# EAGLE design 503DC24 (EAGLE 7.6.0)
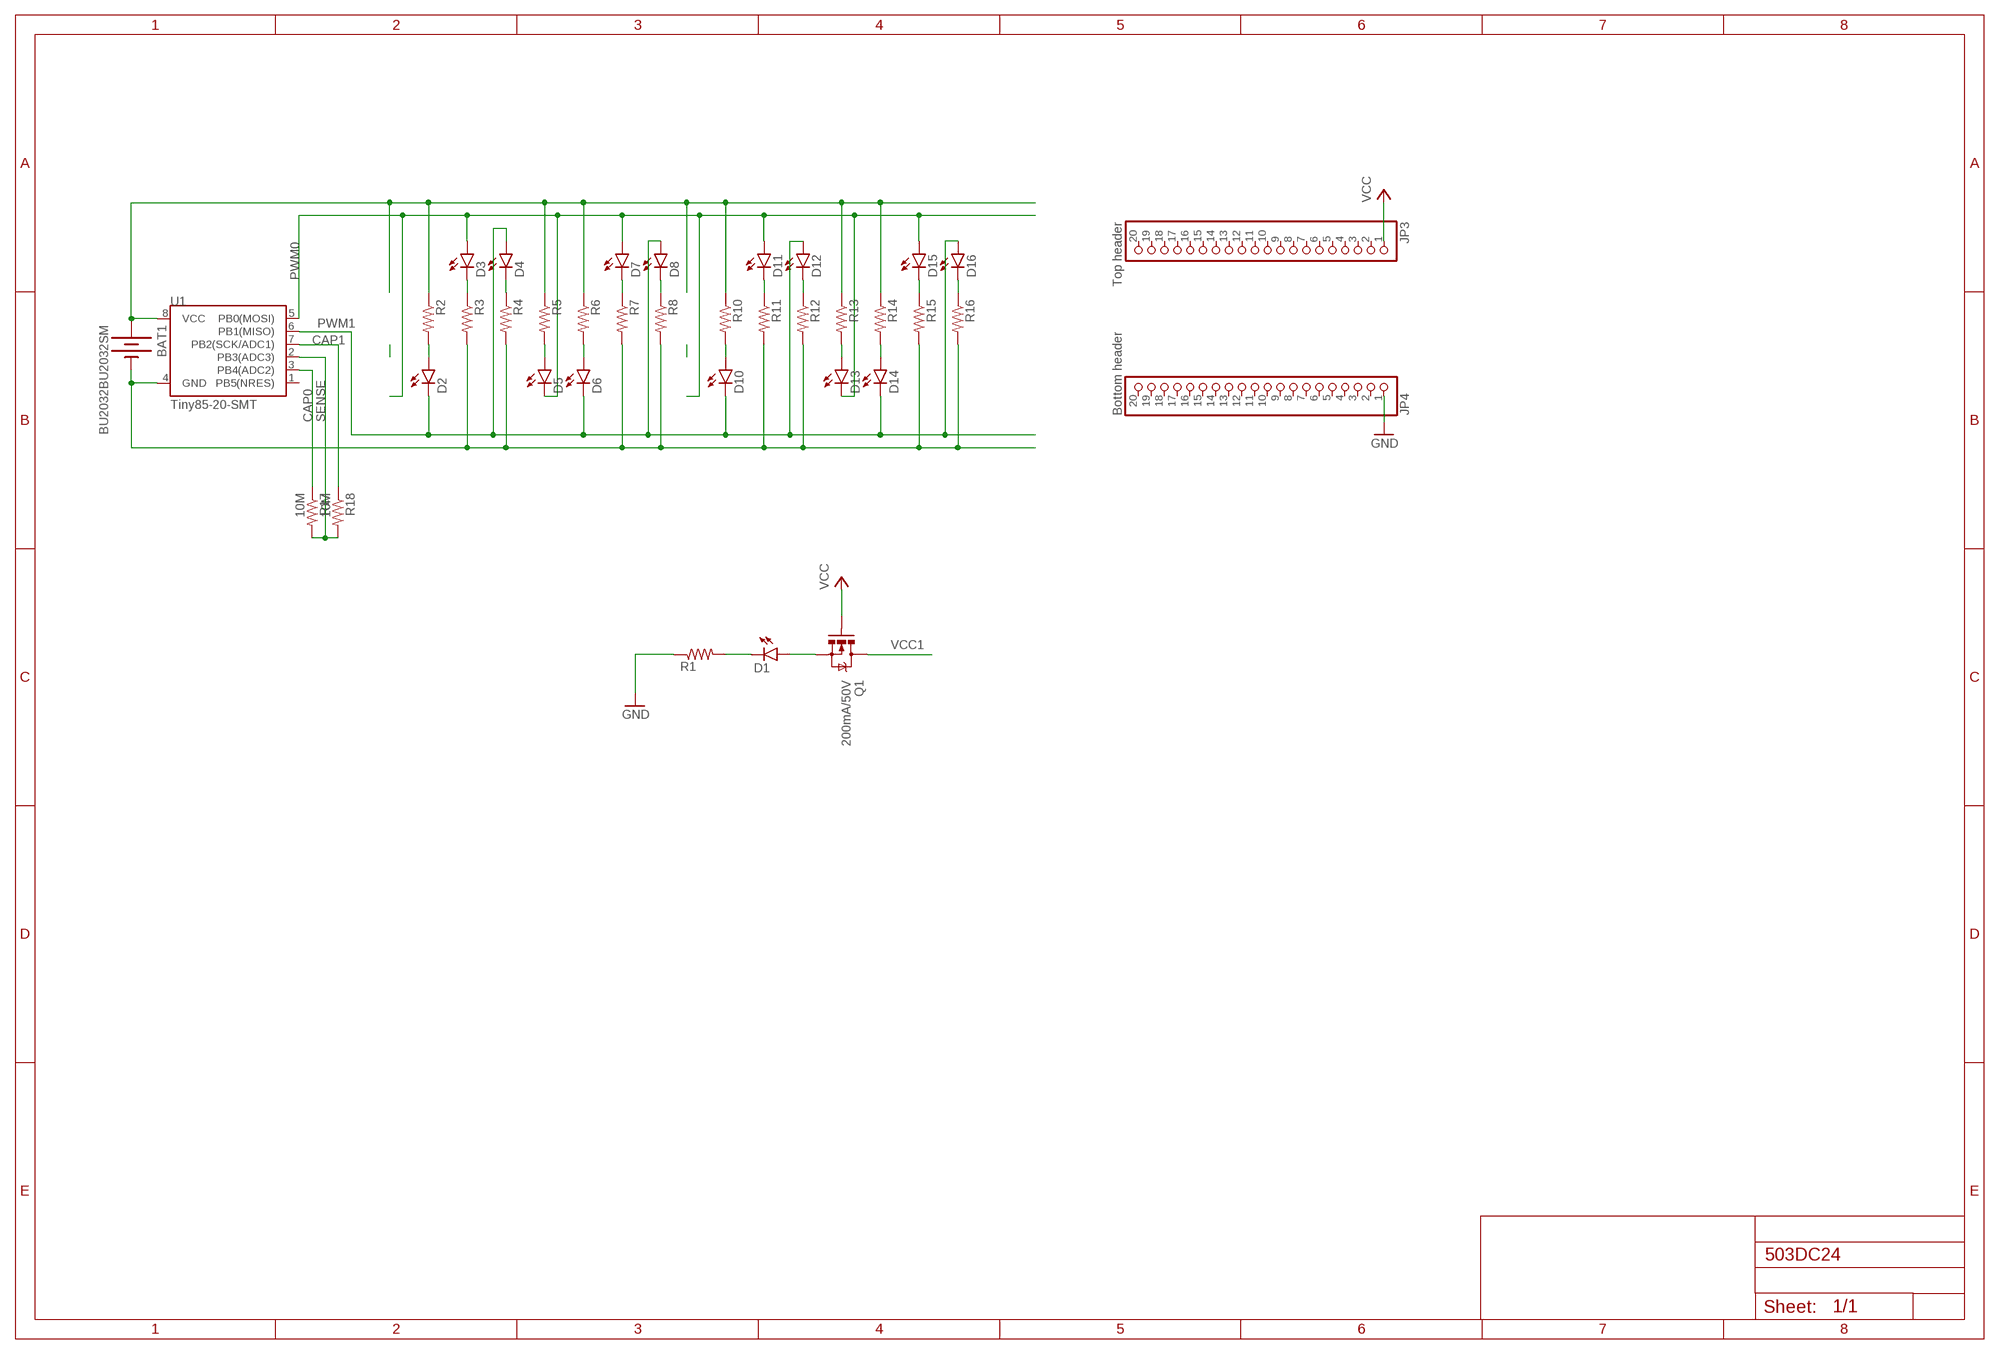
[diagram p0: schematic, sheet 1]

## Parts
BAT1  BU2032BU2032SM  [BU2032SM]
D1  LED1206-BOTTOM-SMALL_SILK  [LED-REV-MNT-SMALLSILK]
D2  LED1206-BOTTOM-SMALL_SILK  [LED-REV-MNT-SMALLSILK]
D3  LED1206-BOTTOM-SMALL_SILK  [LED-REV-MNT-SMALLSILK]
D4  LED1206-BOTTOM-SMALL_SILK  [LED-REV-MNT-SMALLSILK]
D5  LED1206-BOTTOM-SMALL_SILK  [LED-REV-MNT-SMALLSILK]
D6  LED1206-BOTTOM-SMALL_SILK  [LED-REV-MNT-SMALLSILK]
D7  LED1206-BOTTOM-SMALL_SILK  [LED-REV-MNT-SMALLSILK]
D8  LED1206-BOTTOM-SMALL_SILK  [LED-REV-MNT-SMALLSILK]
D10  LED1206-BOTTOM-SMALL_SILK  [LED-REV-MNT-SMALLSILK]
D11  LED1206-BOTTOM-SMALL_SILK  [LED-REV-MNT-SMALLSILK]
D12  LED1206-BOTTOM-SMALL_SILK  [LED-REV-MNT-SMALLSILK]
D13  LED1206-BOTTOM-SMALL_SILK  [LED-REV-MNT-SMALLSILK]
D14  LED1206-BOTTOM-SMALL_SILK  [LED-REV-MNT-SMALLSILK]
D15  LED1206-BOTTOM-SMALL_SILK  [LED-REV-MNT-SMALLSILK]
D16  LED1206-BOTTOM-SMALL_SILK  [LED-REV-MNT-SMALLSILK]
JP3  Top header  PINHD-1X20  [1X20]
JP4  Bottom header  PINHD-1X20  [1X20]
Q1  200mA/50V  MOSFET-NCHANNELBSS138  [SOT23-3]
R1  RESISTOR1206  [1206]
R2  RESISTOR1206  [1206]
R3  RESISTOR1206  [1206]
R4  RESISTOR1206  [1206]
R5  RESISTOR1206  [1206]
R6  RESISTOR1206  [1206]
R7  RESISTOR1206  [1206]
R8  RESISTOR1206  [1206]
R10  RESISTOR1206  [1206]
R11  RESISTOR1206  [1206]
R12  RESISTOR1206  [1206]
R13  RESISTOR1206  [1206]
R14  RESISTOR1206  [1206]
R15  RESISTOR1206  [1206]
R16  RESISTOR1206  [1206]
R17  10M  RESISTOR0805-RES  [0805]
R18  10M  RESISTOR0805-RES  [0805]
U1  Tiny85-20-SMT  ATTINY45TINY85-20-SMT  [SO08-EIAJ]

## Nets
CAP0: R17.1 U1.3(PB4(ADC2))
CAP1: R18.1 U1.7(PB2(SCK/ADC1))
GND: JP4.1 R1.1
GND1: BAT1.P-(-) R3.2 R4.2 R7.2 R8.2 R11.2 R12.2 R15.2 R16.2 U1.4(GND)
N$2: D2.A R2.2
N$3: D3.C R3.1
N$4: D4.C R4.1
N$5: D5.A R5.2
N$6: D6.A R6.2
N$7: D16.C R16.1
N$8: D15.C R15.1
N$14: D10.A R10.2
N$15: D12.C R12.1
N$16: D11.C R11.1
N$17: D8.C R8.1
N$18: D7.C R7.1
N$21: D13.A R13.2
N$22: D14.A R14.2
N$27: D1.A Q1.2(S)
N$30: D1.C R1.2
PWM0: D3.A D5.C D7.A D11.A D13.C D15.A U1.5(PB0(MOSI))
PWM1: D2.C D4.A D6.C D8.A D10.C D12.A D14.C D16.A U1.6(PB1(MISO))
SENSE: R17.2 R18.2 U1.2(PB3(ADC3))
VCC: JP3.1 Q1.1(G)
VCC1: BAT1.P+(+) Q1.3(D) R2.1 R5.1 R6.1 R10.1 R13.1 R14.1 U1.8(VCC)
Unconnected: JP3.2 JP3.3 JP3.4 JP3.5 JP3.6 JP3.7 JP3.8 JP3.9 JP3.10 JP3.11 JP3.12 JP3.13 JP3.14 JP3.15 JP3.16 JP3.17 JP3.18 JP3.19 JP3.20 JP4.2 JP4.3 JP4.4 JP4.5 JP4.6 JP4.7 JP4.8 JP4.9 JP4.10 JP4.11 JP4.12 JP4.13 JP4.14 JP4.15 JP4.16 JP4.17 JP4.18 JP4.19 JP4.20 U1.1(PB5(NRES))

## Library data of the parts
BAT1 = Electromechanical:BU2032
D1-D8 D10-D16 = LED:LED: LEDs Standard schematic elements and footprints for 5mm, 3mm, 1206, and 0603 sized LEDs. 5mm - Spark Fun Electronics SKU : COM-00529 (and others)
JP3 JP4 = pinhead:PINHD-1X20: PIN HEADER
Q1 = SparkFun-DiscreteSemi:MOSFET-NCHANNEL: Common NMOSFET Parts MFG P/N Store ID Prod ID FDD8780 TRANS-09984 SI7820DN TRANS-11055 FDS6630A IC-08089 2N7002PW TRANS-11151 FQP30N06L COM-10213 TRANS-10060 BSS123LT1G TRANS-08345 BSS138 TRANS-00830 BS170 2N7000; PROD_ID: TRANS-00830
R1-R8 R10-R18 = SparkFun-Passives:RESISTOR: Resistor Basic schematic elements and footprints for 0603, 1206, and PTH resistors.
U1 = SparkFun-DigitalIC:ATTINY45: Atmel 8-pin 2/4/8kB flash uC; PROD_ID: IC-09092

## Board
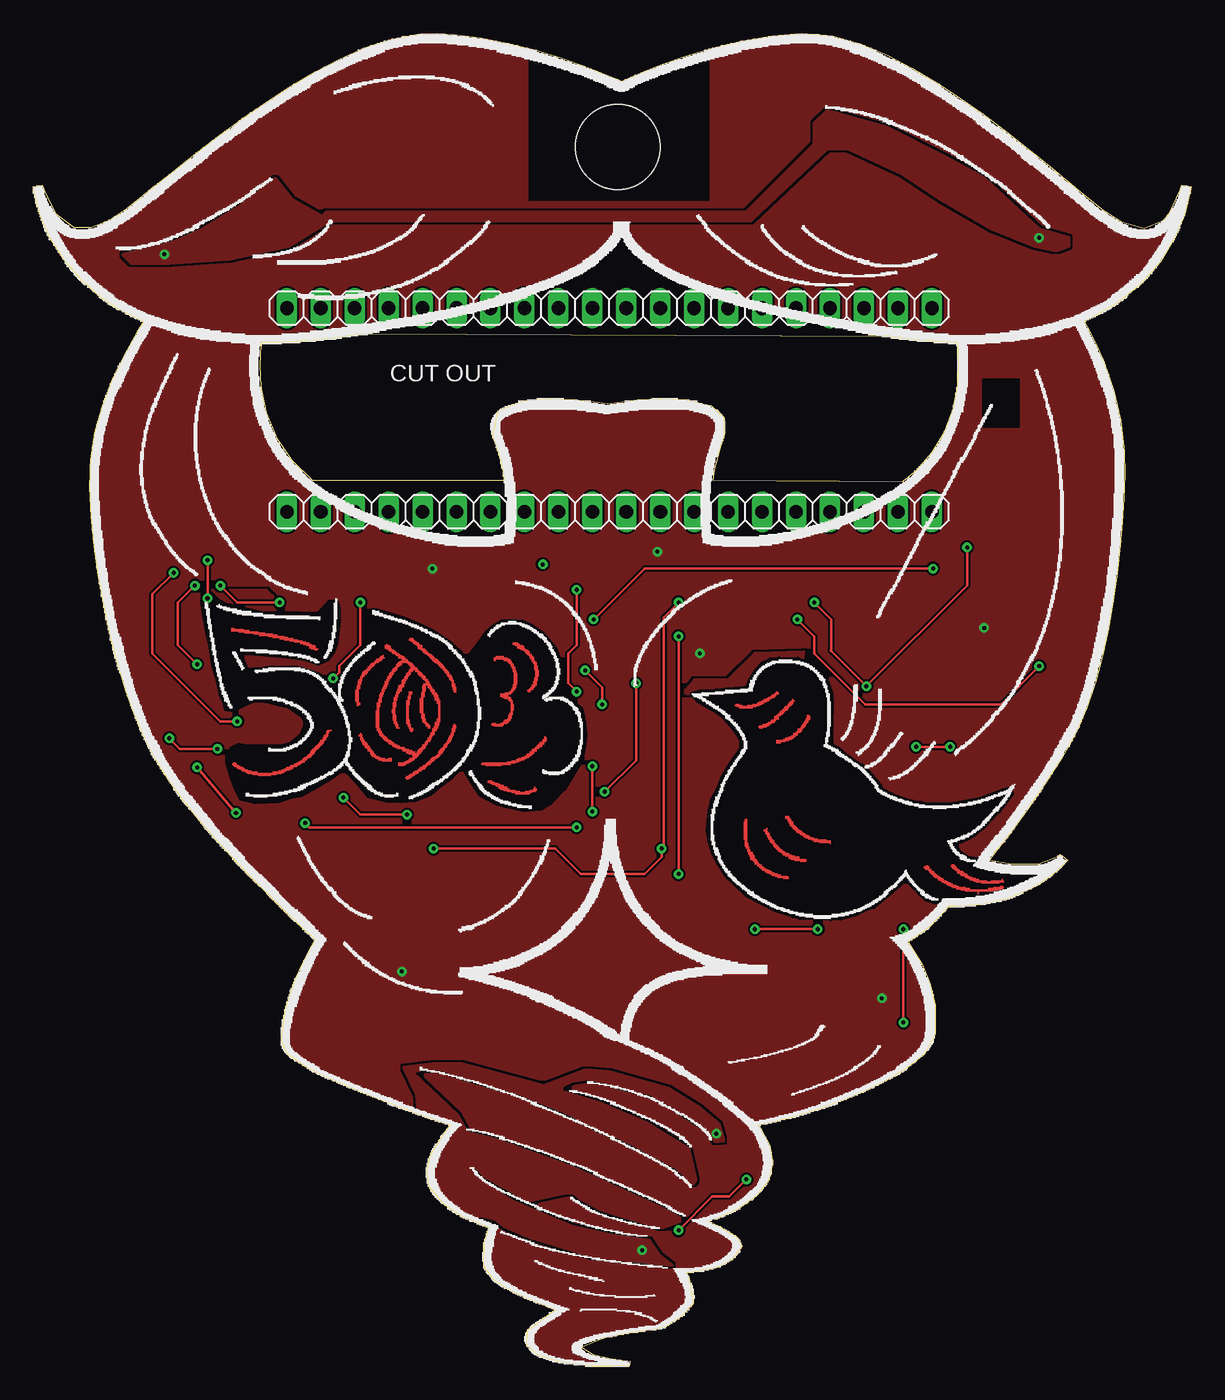
[diagram p1: board, top side]
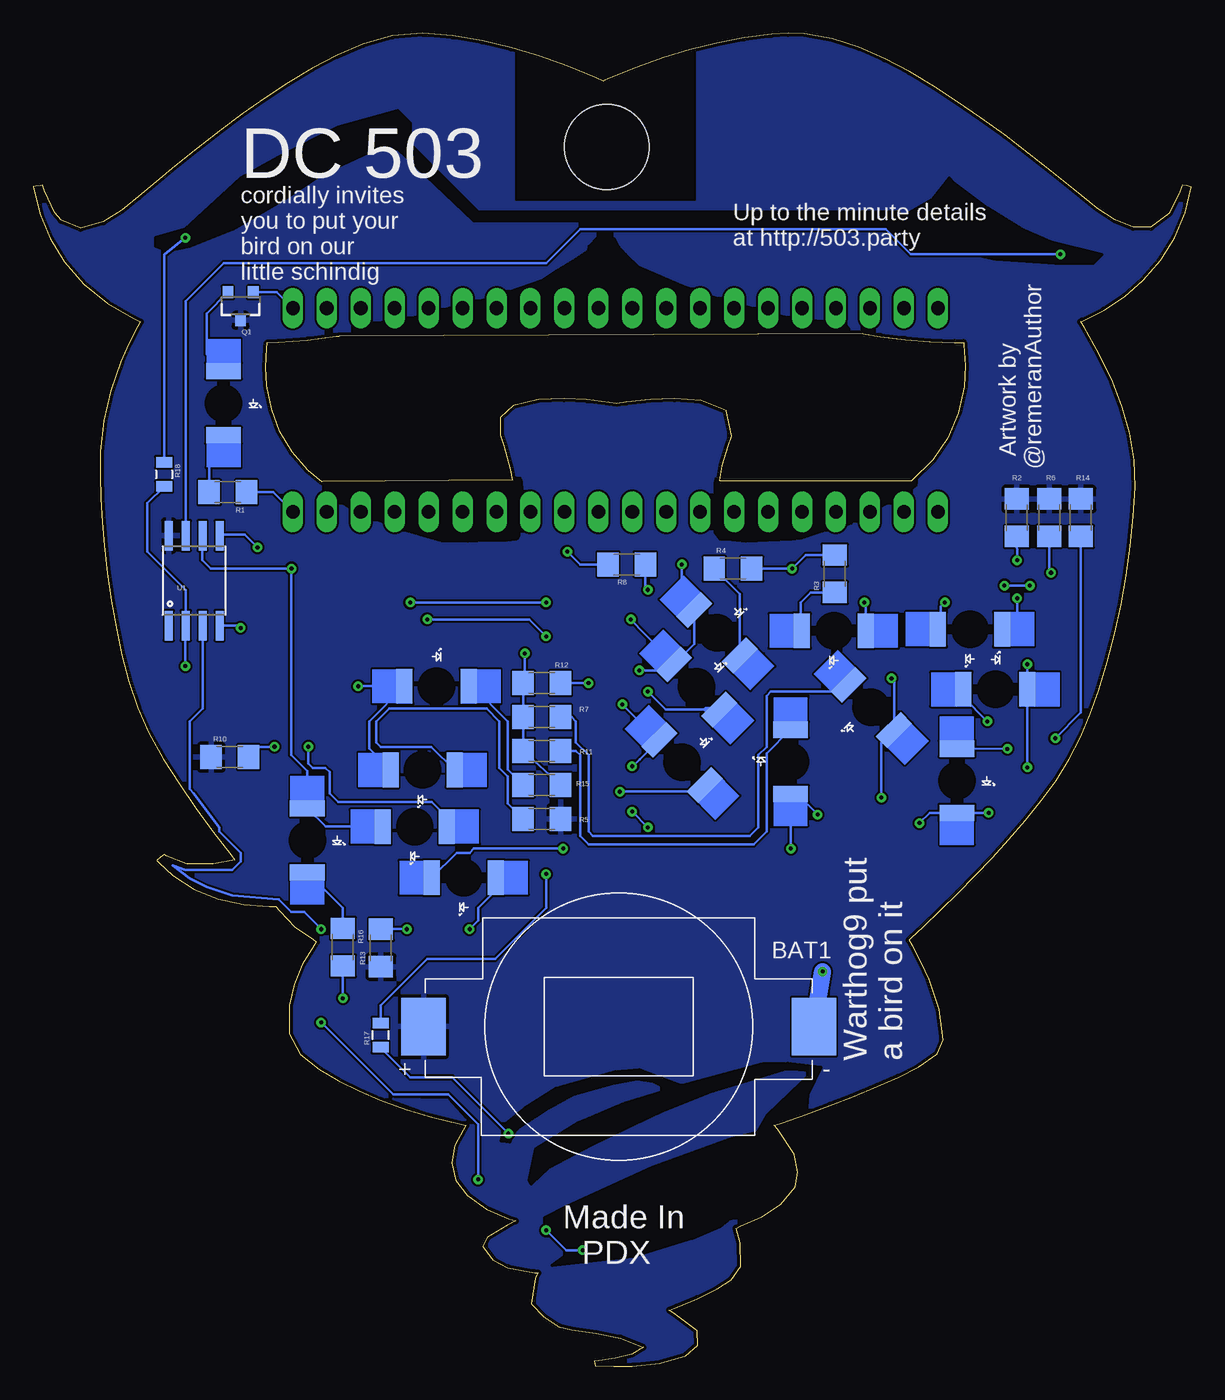
[diagram p2: board, bottom side, seen from below]

Size 86.63 x 99.75 mm. Coordinates in mm from the lower left corner, seen from the top.
Outline: 41.81,0 39.77,0.21 37.8,0.78 36.91,1.55 36.97,2.63 38.74,4 39.04,4.18 38.51,4.41 36.97,5.04 35.47,5.78 34.43,6.47 33.7,7.46 33.74,9.21 34.06,10.31 33.72,10.5 32.14,11.18 30.7,12.09 29.63,13.41 29.44,14.49 29.72,15.85 30.95,17.72 31.18,18.01 30.59,18.22 28.8,18.86 27.02,19.52 25.25,20.2 23.49,20.92 21.92,21.62 20.39,22.39 18.99,23.37 18.54,24.4 18.86,26.72 19.6,28.94 20.19,30.21 20.84,31.44 21.1,31.9 20.95,32.04 20.05,32.88 18.74,34.15 17.45,35.43 16.16,36.72 14.9,38.03 13.63,39.43 12.4,40.86 11.23,42.33 10.11,43.85 9.13,45.44 8.28,47.1 7.55,48.82 6.92,50.58 6.27,52.7 5.72,54.84 5.25,57 4.86,59.18 4.55,61.38 4.32,63.58 4.2,65.79 4.27,67.82 4.6,69.82 5.15,71.78 5.87,73.68 6.86,75.76 8,77.76 8.27,78.18 8.16,78.23 6.51,79.05 4.98,80.06 3.6,81.28 2.29,82.79 1.23,84.48 0.46,86.32 0,88.26 0.34,88.34 0.67,88.41 0.7,88.33 0.89,87.8 1.67,86.26 3.02,85.23 4.34,85.24 5.73,85.82 6.99,86.64 8.78,88.08 10.48,89.45 12.2,90.8 13.93,92.13 15.69,93.42 17.49,94.65 19.26,95.8 21.08,96.87 22.94,97.85 24.87,98.7 26.87,99.36 28.95,99.73 30.17,99.75 31.39,99.68 33.45,99.42 35.49,99.02 37.51,98.52 39.5,97.92 41.46,97.23 42.67,96.75 43.87,96.24 44.01,96.17 44.56,96.42 46.63,97.28 48.74,98.03 50.88,98.67 53.06,99.19 55.27,99.57 57.49,99.75 59.77,99.57 61.97,98.93 63.91,98.11 65.77,97.13 67.58,96.06 69.34,94.9 71.06,93.69 72.74,92.43 74.4,91.14 76.04,89.82 77.66,88.47 78.78,87.52 80.04,86.51 81.39,85.64 83.1,85.16 84.56,85.77 85.03,86.32 85.79,87.94 85.94,88.39 86.1,88.37 86.44,88.31 86.63,88.27 86.61,88.1 86.13,86.19 85.36,84.37 84.33,82.69 82.85,80.98 81.1,79.56 79.15,78.43 78.63,78.18 78.82,77.84 79.5,76.53 80.1,75.19 80.84,73.01 81.36,70.76 81.62,68.47 81.65,66.7 81.58,64.94 81.47,63.18 81.32,61.42 81.09,59.36 80.8,57.31 80.45,55.27 80.01,53.24 79.48,51.24 78.82,49.27 78,47.37 76.91,45.45 75.72,43.59 74.47,41.77 73.17,39.99 71.81,38.25 71.56,37.87 73.16,37.58 75.17,37.57 76.71,38.19 76.84,38.3 77.13,38.08 77.39,37.86 77.25,37.7 76.21,36.71 74.58,35.69 72.79,34.97 70.91,34.56 68.99,34.42 68.49,34.42 68.2,34.05 67.06,32.87 65.71,31.95 65.45,31.74 65.66,31.45 66.5,30.07 67.12,28.56 67.47,26.98 67.49,24.88 66.65,23.33 65.24,22.21 63.79,21.35 62.27,20.59 60.71,19.92 58.75,19.21 56.77,18.61 54.75,18.11 54.28,18.01 54.47,17.69 55.1,16.51 55.34,15.21 55.03,13.92 54.16,12.79 52.72,11.74 51.08,11.04 50.54,10.86 51.16,10.56 52.68,9.63 53.02,8.96 52.26,7.97 51.13,7.37 49.12,7 48.88,6.97 49.08,6.58 49.37,4.65 48.44,3.69 47.32,2.94 46.36,2.71 44.52,2.45 42.69,2.09 41.02,1.39 41.85,0.89 43.08,0.6 44.33,0.4 44.66,0.36 44.64,0.21 44.6,0.03 43.21,0 41.81,0
Outline: 41.81,0 41.81,0
Outline: 35.07,67.39 34.66,68.87 34.39,69.63 34.79,71.51 36.64,72.28 38.67,72.41 40.48,72.34 42.29,72.14 42.97,72.05 43.54,72.13 45.23,72.32 46.92,72.4 48.86,72.35 50.73,71.88 51.68,70.99 51.71,69.68 51.43,68.91 50.94,67.1
Outline: 66.09,67.05 67.27,68.41 68.19,69.95 68.81,71.63 69.17,73.38 69.23,74.79 69.19,76.2 69.13,76.59 68.31,76.64 66.14,76.81 63.98,77.09 63.76,77.1 24.58,77.26 23.25,77.07 21.41,76.84 19.56,76.67 17.7,76.61 17.02,76.61 17,76.48 16.92,74.9 17,73.33 17.43,71.35 18.21,69.48 19.34,67.8 20.91,66.3 35.26,66.29 35.08,67.39
Outline: 50.95,67.09 50.82,66.31 65.04,66.19 66.1,67.06
Copper layers (1*16): Top 0.035mm / dielectric 1.5mm / Bottom 0.035mm
Design rules "default *": minimum track width 6mil, minimum drill 12mil, track to track 6mil, track to pad 6mil, pad to pad 6mil, via to via 6mil, smd to smd 6mil, copper to edge 10mil, drill to drill 8mil, minimum pad ring 10mil, minimum via ring 8mil, stop-mask expansion 4mil, vias tented up to drill 0mil, thermal gap 10mil
Holes 6.35 mm at 43.73,91.25

### Footprints (pad centres in the part's own frame; a part is rotated, then mirrored left to right if it is on the bottom)
BU2032SM = smd 3.302 x 4.318: P+ -14.605,0; P- 14.605,0
LED-REV-MNT-SMALLSILK = smd 1.2 x 2.6: A -2.4,0; C 2.4,0
1X20 = drill 1.016 long: 1 -24.13,0; 2 -21.59,0; 3 -19.05,0; 4 -16.51,0; 5 -13.97,0; 6 -11.43,0; 7 -8.89,0; 8 -6.35,0; 9 -3.81,0; 10 -1.27,0; 11 1.27,0; 12 3.81,0; 13 6.35,0; 14 8.89,0; 15 11.43,0; 16 13.97,0; 17 16.51,0; 18 19.05,0; 19 21.59,0; 20 24.13,0
SOT23-3 = smd 0.8 x 0.9: 1 -0.95,-1; 2 0.95,-1; 3 0,1.1
1206 = smd 1.6 x 1.8: 1 -1.4,0; 2 1.4,0
0805 = smd 0.8 x 1.2: 1 -0.9,0; 2 0.9,0
SO08-EIAJ = smd 0.61 x 2.21: 1 -1.905,-3.378; 2 -0.635,-3.378; 3 0.635,-3.378; 4 1.905,-3.378; 5 1.905,3.353; 6 0.635,3.353; 7 -0.635,3.353; 8 -1.905,3.353

### Placement (x,y rotation side)
BAT1  42.83,25.41 0 bottom
D1  72.4,72.08 270 bottom
D2  16.55,55.16 180 bottom
D3  26.74,55.04 180 bottom
D4  35.48,54.89 315 bottom
D5  57.51,44.63 180 bottom
D6  14.65,50.66 0 bottom
D7  23.94,49.3 135 bottom
D8  37,50.84 315 bottom
D10  58.09,40.38 180 bottom
D11  29.98,45.23 90 bottom
D12  38.09,45.19 315 bottom
D13  54.43,36.56 180 bottom
D14  17.53,43.81 270 bottom
D15  56.47,50.89 0 bottom
D16  66.13,39.36 270 bottom
JP3  43.09,79.19 180 top
JP4  43.09,63.95 180 top
Q1  71.13,79.38 180 bottom
R1  72.08,65.41 180 bottom
R2  13.04,63.5 270 bottom
R3  26.67,59.31 90 bottom
R4  34.29,59.68 0 bottom
R5  48.59,40.96 180 bottom
R6  10.63,63.5 270 bottom
R7  48.59,48.58 180 bottom
R8  42.24,60.01 180 bottom
R10  71.93,45.58 0 bottom
R11  48.59,46.04 180 bottom
R12  48.59,51.12 180 bottom
R13  60.64,31.3 90 bottom
R14  8.25,63.5 270 bottom
R15  48.59,43.5 0 bottom
R16  63.47,31.36 270 bottom
R17  60.64,24.78 90 bottom
R18  76.85,66.74 270 bottom
U1  74.6,58.81 0 bottom

### Tracks (layer width: path | path; a pad name or v marks a point on that pad's centre or on a via)
CAP0  (via drill 0.3)
  Top 0.178: v65.1,32.71 v65.1,25.72 | v53.35,13.97 52.08,12.7 50.81,12.7 v48.27,10.16
  Bottom 0.178: U1.3 73.97,49.24 74.94,48.26 74.94,43.18 74.62,42.87 72.72,40.33 72.72,40.01 71.13,38.42 71.13,37.79 71.77,37.15 75.26,37.15 76.21,37.47 74.94,36.52 73.67,35.88 71.77,35.25 68.27,34.93 67.32,33.98 66.37,33.98 v65.1,32.71 | v65.1,25.72 59.7,20.32 55.57,20.32 53.35,18.1 v53.35,13.97 | v48.27,10.16 46.78,8.67 v45.54,8.67 | v51.1,17.4 55.29,21.59 58.43,21.59 60.64,23.81 R17.1
  pour Top: 51.64,16.86 51.29,18.13 49.92,19.24 47.48,20.8 43.1,22.01 41.32,22.17 38.17,20.99 32.05,22.61 30.17,22.67 27.73,22.36 28.68,20.36 28.94,16.99 29.6,12.61 29.86,11.59 30.78,10.67 33.51,11.24 34.52,11.02 35.22,10.48 37.32,9.56 37.54,9.53 41.79,8.23 47.79,7.56 46.81,8.29 46.08,9.43 43.29,9.78 40.24,10.45 35.76,12.39 33.79,13.56 32.43,14.8 33.13,14.9 33.76,14.2 35.7,13.12 37.1,12.39 39.13,12.83 39.89,12.96 40.43,12.96 40.84,12.58 42.4,11.72 44.18,11.18 47.03,10.35 48.37,10.83 48.37,11.09 46.78,11.91 40.3,14.9 34.52,16.96 32.43,17.5 31.7,18.8 28.36,21.98 28.9,22.17 29.92,22.23 30.36,22.26 31.44,21.91 36.02,20.51 39.64,19.05 42.27,17.85 44.91,16.58 48.08,14.9 49.38,13.66 49.54,13.91 49.03,16.23 45.83,18.2 42.4,19.66 39.44,20.58 39.57,20.96 40.27,21.31 41.48,21.5 43.29,21.18 46.24,20.32 48.4,19.15 50.3,17.91 50.81,17.31 51,16.8
  cutout Bottom: 51.64,16.86 51.29,18.13 49.92,19.24 47.48,20.8 43.1,22.01 41.32,22.17 38.17,20.99 32.05,22.61 30.17,22.67 27.73,22.36 28.68,20.36 28.94,16.99 29.6,12.61 29.86,11.59 30.78,10.67 33.51,11.24 34.52,11.02 35.22,10.48 37.32,9.56 37.54,9.53 41.79,8.23 47.79,7.56 46.81,8.29 46.08,9.43 43.29,9.78 40.24,10.45 35.76,12.39 33.79,13.56 32.43,14.8 33.13,14.9 33.76,14.2 35.7,13.12 37.1,12.39 39.13,12.83 39.89,12.96 40.43,12.96 40.84,12.58 42.4,11.72 44.18,11.18 47.03,10.35 48.37,10.83 48.37,11.09 46.78,11.91 40.3,14.9 34.52,16.96 32.43,17.5 31.7,18.8 28.36,21.98 28.9,22.17 29.92,22.23 30.36,22.26 31.44,21.91 36.02,20.51 39.64,19.05 42.27,17.85 44.91,16.58 48.08,14.9 49.38,13.66 49.54,13.91 49.03,16.23 45.83,18.2 42.4,19.66 39.44,20.58 39.57,20.96 40.27,21.31 41.48,21.5 43.29,21.18 46.24,20.32 48.4,19.15 50.3,17.91 50.81,17.31 51,16.8
CAP1  (via drill 0.3)
  Bottom 0.178: U1.7 75.24,79.72 72.4,82.55 48.27,82.55 45.73,85.09 22.87,85.09 21,83.22 v9.79,83.22 | v75.26,84.46 76.85,83.19 76.85,80.35 76.84,80.34 R18.1
  pour Top: 17.79,88.59 15.25,86.68 12.71,85.09 10.49,84.14 6.68,83.19 7.31,82.55 10.17,82.55 14.62,82.87 19.06,83.82 21.6,85.41 22.24,85.73 53.67,85.73 59.38,91.13 60.97,91.13 65.1,89.22 67.96,87.32 71.77,85.09 74.94,83.82 76.53,83.51 77.48,83.82 77.48,84.46 75.26,85.09 71.13,88.9 68.27,90.49 63.83,92.71 59.38,93.98 58.43,93.03 58.43,91.44 53.35,86.36 21.92,86.36 21.6,86.05 19.38,87.32 18.11,88.9
  cutout Bottom: 17.79,88.59 15.25,86.68 12.71,85.09 10.49,84.14 6.68,83.19 7.31,82.55 10.17,82.55 14.62,82.87 19.06,83.82 21.6,85.41 22.24,85.73 53.67,85.73 59.38,91.13 60.97,91.13 65.1,89.22 67.96,87.32 71.77,85.09 74.94,83.82 76.53,83.51 77.48,83.82 77.48,84.46 75.26,85.09 71.13,88.9 68.27,90.49 63.83,92.71 59.38,93.98 58.43,93.03 58.43,91.44 53.35,86.36 21.92,86.36 21.6,86.05 19.38,87.32 18.11,88.9
GND
  Bottom 0.178: JP4.1 68.68,65.41 R1.1
GND1  (via drill 0.3)
  Bottom 0.178: R16.2 v63.48,27.53 | U1.4 71.31,55.43 v71.13,55.25 | R4.2 29.87,59.69 | R3.2 28.84,60.71 v29.86,59.69 | R8.2 45.73,60.01 v46.68,60.96 | v49.86,53.34 49.86,51.25 R12.2 R7.2 R11.2 R15.2
  Bottom 0.406: 29.87,59.69 v29.86,59.69
  Bottom 1.27: BAT1.P- v27.57,29.53
  pour Top (rank 6): 0.01,0 91.36,0 91.36,104.22 50.81,104.14 50.81,87 36.84,87 36.84,104.22 0.01,104.22
N$1
  cutout Top: 49.29,50.33 49.95,50.52 51.1,50.58 51.92,50.68 52.97,50.74 53.45,50.84 53.7,51.5 54.11,52.14 54.53,52.58 55.16,52.9 55.48,52.9 55.8,52.96 57.19,52.93 57.51,52.8 58.11,52.58 58.49,52.33 58.81,52.04 59.19,51.63 59.51,50.9 59.7,50.33 59.73,49.72 59.7,47.88 59.7,46.96 59.61,46.99 59.54,46.71 59.54,46.55 60.21,46.23 60.65,45.85 61.19,45.47 61.99,44.96 62.43,44.55 62.91,43.98 63.32,43.5 63.35,43.31 63.51,43.15 64.21,42.8 64.94,42.52 65.7,42.26 66.43,42.17 66.81,42.07 68.84,42.1 70.34,42.36 70.88,42.49 71.67,42.77 72.5,43.09 72.88,43.22 73.04,43.15 73.19,42.93 73.19,42.77 73.1,42.64 72.24,41.5 72.02,41.34 71.07,40.33 70.43,39.79 69.86,39.47 69.35,39.25 68.84,39.12 68.97,38.93 69.04,38.77 69.38,38.42 69.92,38.07 70.69,37.95 70.97,37.6 71.8,37.31 72.97,37.15 74.02,37.12 75.35,37.09 75.51,36.99 75.54,36.68 75.39,36.49 73.51,35.66 72.05,35.15 70.43,34.83 68.18,34.68 67.38,34.71 66.78,34.93 66.3,35.37 65.8,35.91 65.57,36.14 65.29,36.55 64.81,36.01 63.96,35.28 62.88,34.36 62.08,34.1 61.45,33.79 60.4,33.5 59.64,33.47 57.35,33.53 56.81,33.69 55.64,34.07 53.38,35.25 52.46,36.1 51.89,36.64 51.32,37.5 50.91,38.29 50.62,39.28 50.46,40.1 50.62,41.57 50.81,42.39 51.22,43.22 51.6,44.17 52.14,45.06 52.68,45.85 53,46.26 52.97,46.84 52.49,47.63 51.64,48.55 50.87,49.12 49.7,49.79
N$2  (via drill 0.3)
  Top 0.178: v13.03,57.47 v13.03,60.33
  Bottom 0.178: D2.A 13.03,56.28 v13.03,57.47 | v13.03,60.33 R2.2
N$3
  Bottom 0.178: R3.1 28.47,57.91 29.22,57.15 29.22,55.12 D3.C
N$4
  Bottom 0.178: R4.1 33.79,57.79 D4.C
N$5
  Bottom 0.178: R5.2 51.13,42.1 51.13,44.14 51.76,44.77 51.76,48.26 52.72,49.22 60.02,49.22 60.97,48.26 60.97,46.68 60.65,46.36 56.84,46.36 D5.A
N$6  (via drill 0.3)
  Top 0.178: v10.49,59.38 8.9,57.79 8.9,53.34 13.98,48.26 v15.25,48.26
  Bottom 0.178: 16.9,50.8 D6.A 17.05,50.07 v15.25,48.26 | v10.49,59.38 10.63,59.52 R6.2
N$7
  Bottom 0.178: D16.C 63.47,34.29 R16.1
N$8
  Bottom 0.178: D15.C 53.75,50.89 51.13,48.26 51.13,44.64 R15.1
N$9
  cutout Top: 13,57.82 14.36,57.09 15.82,56.74 17.03,56.46 18.62,56.39 19.92,56.39 21.25,56.36 22.11,57.28 22.52,57.31 22.78,57.19 22.93,56.61 22.9,55.79 22.74,54.14 22.46,53.41 22.05,52.87 21.47,52.58 21.32,52.52 20.78,52.71 20.33,52.84 19.63,52.96 18.58,53.06 17.73,53.15 16.49,53.25 15.63,53.34 15.38,53.34 15.7,52.84 15.92,52.36 16.01,52.17 16.46,52.2 17,52.23 17.51,52.33 19.51,52.36 19.79,52.33 20.55,52.11 21.44,51.82 21.89,51.47 22.3,50.93 22.68,50.46 22.78,51.09 22.93,51.63 23.12,52.26 23.76,53.03 24.65,53.69 25.09,54.17 25.13,54.77 24.97,55.98 25.13,56.46 25.38,56.68 25.7,56.65 26.27,56.49 27.7,56.04 28.81,55.6 29.92,55.06 31.32,54.14 31.92,53.57 32.33,52.93 33.41,54.27 33.89,55 34.36,55.38 35.03,55.82 35.63,55.85 36.65,55.76 37.38,55.44 38.17,54.84 39.13,53.69 39.51,52.65 39.54,52.2 39.54,51.63 39.44,50.87 39.1,50.42 38.84,50.23 39.83,50.2 40.37,49.85 41.03,49.25 41.19,48.71 41.29,48.11 41.35,47.18 41.29,46.49 41.22,46.07 41.1,45.47 40.91,45.06 40.14,43.76 39.76,43.15 38.78,42.14 38.02,41.66 36.71,41.57 35.54,41.82 34.65,42.04 33.41,42.71 32.87,43.5 32.3,44.42 32.3,44.99 31.38,44.07 30.36,43.31 29.76,42.8 28.55,42.3 27.44,42.23 26.4,42.26 25.06,42.61 24.43,43.34 23.44,44.39 23.25,44.74 22.71,44.23 22.05,43.85 21.19,43.31 20.05,42.68 19.22,42.52 18.33,42.23 16.62,42.17 15.47,42.42 15.19,42.99 14.77,44.04 14.43,45.22 14.46,45.72 14.81,46.3 15.35,46.55 16.04,46.45 18.46,46.45 19.22,46.65 19.6,46.93 20.01,47.28 20.24,47.79 20.3,48.23 20.11,48.58 19.63,48.93 19.09,49.28 18.43,49.44 17.6,49.66 17,49.76 16.39,49.72 16.04,49.57 15.47,49.28 15.09,49.06 14.65,49.09 14.36,49.12 14.2,49.69 13.95,50.26 13.66,51.5 13.38,52.49 13.16,53.98 12.93,54.93 12.68,56.36 12.55,57.28
N$10
  pour Bottom (rank 2): 64.78,42.55 64.46,42.55 63.83,41.91 56.84,41.91 56.53,41.6 56.53,40.33 62.88,40.33 63.19,40.64 64.46,40.64 64.78,40.96
N$11
  pour Bottom (rank 2): 59.07,46.04 59.07,44.45 56.21,44.45 55.89,44.45 55.89,45.09 56.21,45.41 56.84,46.04
N$12
  pour Bottom (rank 2): 54.94,50.8 57.8,50.8 58.11,50.8 58.11,49.53 54.94,49.53
N$13
  pour Top: 13.35,58.11 17.47,58.11 18.11,57.47 18.11,56.52 14.93,56.52
N$14  (via drill 0.3)
  Top 0.178: v66.05,46.36 v68.59,46.36
  Bottom 0.178: D10.A 55.7,41.08 56.84,42.23 63.83,42.23 64.46,42.87 64.46,44.45 64.78,44.77 65.73,44.77 66.05,45.09 v66.05,46.36 | v68.59,46.36 69.75,46.36 R10.2
N$15  (via drill 0.3)
  Top 0.178: v42.75,42.99 45.1,45.34 v45.1,51.12
  Bottom 0.178: D12.C 36.4,43 36.71,43 v42.75,42.99 | v45.1,51.12 R12.1
N$16
  Bottom 0.178: D11.C 31.76,45.85 31.76,40.01 32.71,39.06 45.1,39.06 45.73,39.69 45.73,45.72 46.05,46.04 R11.1
N$17  (via drill 0.3)
  Top 0.178: v40.65,58.11 40.65,53.98 40.02,53.34 40.02,51.12 v40.65,50.49
  Bottom 0.178: v40.65,58.11 40.84,58.29 R8.1 | v40.65,50.49 39.3,49.14 D8.C
  Bottom 0.406: D8.C 36.28,49.14
N$18
  Bottom 0.178: D7.C 26.15,50.49 31.44,50.49 31.76,50.17 31.76,46.36 32.4,45.72 32.4,40.33 33.03,39.69 44.78,39.69 45.1,40.01 45.1,45.72 46.05,46.68 46.05,48.26 46.37,48.58 R7.1
N$19
  pour Bottom: 55.67,19.94 59.7,20.01 57.16,19.05 54.62,18.42 54.3,18.42
N$20
  pour Top: 43.19,38.42 43.51,37.47 44.14,35.88 45.1,34.29 45.92,33.25 46.56,32.45 47.51,31.75 49,30.96 50.02,30.48 50.56,30.2 50.65,29.98 50.56,29.79 50.37,29.69 49.29,29.5 48.59,29.37 47.73,29.18 47.03,28.8 46.14,28.33 45.41,27.79 45.03,27.15 44.68,26.39 44.46,25.91 44.33,25.47 44.27,24.96 44.18,24.58 43.86,24.55 43.32,24.83 43.06,25.09 41.95,25.72 40.62,26.42 39.06,27.15 38.21,27.63 37.1,27.98 36.36,28.26 35.44,28.55 34.36,28.83 33.73,29.06 33.7,29.37 33.82,29.6 34.27,29.79 35.06,29.91 35.92,30.17 37.06,30.67 37.76,31.02 38.56,31.47 39.1,31.94 39.83,32.58 40.37,33.12 40.84,33.6 41.25,34.33 41.57,34.8 41.92,35.34 42.11,35.95 42.43,36.74 42.65,37.56 42.84,38.14 43.16,38.42
N$21  (via drill 0.3)
  Top 0.178: v53.99,32.71 v58.69,32.71
  Bottom 0.178: D13.A 52.03,35.62 53.35,34.29 53.35,33.34 v53.99,32.71 | v58.69,32.71 60.62,32.71 R13.2
N$22  (via drill 0.3)
  Top 0.178: v13.76,46.2 10.96,46.2 v10.17,46.99
  Bottom 0.178: 8.27,61.64 R14.2 8.25,59.69 8.25,59.39 | D14.A v13.76,46.2 | 8.27,59.38 8.25,59.39 | v10.17,46.99 8.25,48.91 8.25,59.39
N$23
  cutout Top: 20.78,66.52 35.57,66.43 35.67,66.14 35.67,62.39 35.25,61.89 34.75,61.85 33.32,61.73 29.92,61.85 29.22,61.95 28.01,62.36 27.41,62.55 26.49,62.77 25.44,63.06 25.16,63.31 24.39,63.66 23.25,64.3 22.46,64.74 21.63,65.09 20.9,65.6 20.59,65.92 20.55,66.14 20.52,66.39 20.71,66.52
  cutout Bottom: 20.78,66.52 35.57,66.43 35.67,66.14 35.67,62.39 35.25,61.89 34.75,61.85 33.32,61.73 29.92,61.85 29.22,61.95 28.01,62.36 27.41,62.55 26.49,62.77 25.44,63.06 25.16,63.31 24.39,63.66 23.25,64.3 22.46,64.74 21.63,65.09 20.9,65.6 20.59,65.92 20.55,66.14 20.52,66.39 20.71,66.52
N$24
  cutout Top: 50.78,66.58 65,66.23 64.94,65.95 64.91,65.54 64.75,65.35 63.86,64.84 62.94,64.23 61.51,63.54 60.56,63.22 59.19,62.65 57.76,62.23 56.08,61.76 55.26,61.76 54.14,61.73 52.65,61.79 51.22,61.79 50.56,61.85 50.4,61.95 50.27,62.17 50.24,62.55 50.05,63.06 50.02,63.44 50.05,63.98 50.02,64.96 50.05,65.6 50.08,66.2 50.21,66.46 50.81,66.55 50.81,66.58
  cutout Bottom: 50.78,66.58 65,66.23 64.94,65.95 64.91,65.54 64.75,65.35 63.86,64.84 62.94,64.23 61.51,63.54 60.56,63.22 59.19,62.65 57.76,62.23 56.08,61.76 55.26,61.76 54.14,61.73 52.65,61.79 51.22,61.79 50.56,61.85 50.4,61.95 50.27,62.17 50.24,62.55 50.05,63.06 50.02,63.44 50.05,63.98 50.02,64.96 50.05,65.6 50.08,66.2 50.21,66.46 50.81,66.55 50.81,66.58
N$25
  cutout Top: 62.75,76.97 25.54,77.03 25.6,77.63 25.86,77.95 26.71,78.01 28.43,78.33 30.4,78.55 31.44,78.81 33.22,79.32 35.95,80.08 38.08,80.87 41.32,82.27 42.3,83.22 42.91,83.89 43.16,84.4 43.57,84.81 44.24,84.81 44.4,84.52 45.06,83.82 45.13,83.48 46.05,82.84 47.67,81.89 48.56,81.28 51.13,80.4 52.49,79.92 53.45,79.7 55.48,79.22 56.91,78.78 58.56,78.46 60.88,78.11 61.8,77.98 62.37,77.89 62.69,77.6 62.78,77.57 62.72,77 62.65,77 62.75,77
  cutout Bottom: 62.75,76.97 25.54,77.03 25.6,77.63 25.86,77.95 26.71,78.01 28.43,78.33 30.4,78.55 31.44,78.81 33.22,79.32 35.95,80.08 38.08,80.87 41.32,82.27 42.3,83.22 42.91,83.89 43.16,84.4 43.57,84.81 44.24,84.81 44.4,84.52 45.06,83.82 45.13,83.48 46.05,82.84 47.67,81.89 48.56,81.28 51.13,80.4 52.49,79.92 53.45,79.7 55.48,79.22 56.91,78.78 58.56,78.46 60.88,78.11 61.8,77.98 62.37,77.89 62.69,77.6 62.78,77.57 62.72,77 62.65,77 62.75,77
N$26
  pour Top (rank 5): 49.45,51.38 51.95,51.41 53.99,53.38 57.64,53.47 57.57,52.33 53.26,50.2 50.02,50.04 48.78,50.36 48.78,50.61 49.41,51.31 49.48,51.34 49.57,51.34
N$27
  Bottom 0.178: Q1.2 73.67,78.79 73.67,75.75 D1.A
N$28
  cutout Top: 71.07,73.82 73.73,73.82 73.73,70.33 71.07,70.33
N$30
  Bottom 0.178: D1.C 73.48,68.59 R1.2
PWM0  (via drill 0.3)
  Top 0.178: v62.33,50.89 69.86,58.42 v69.86,61.28 | v29.95,38.74 39.06,38.74 40.97,36.83 45.73,36.83 47,38.1 v47,38.74 47.16,38.74 47.16,56.04 v48.27,57.15 | 59.65,53.57 v62.33,50.89 | v27.95,41.28 24.46,41.28 v23.19,42.55 | v24.46,57.15 24.46,53.98 22.87,52.39 22.87,51.92 v22.43,51.47 | v58.43,57.15 59.7,55.88 59.7,53.51 v62.33,50.89
  Bottom 0.178: v29.95,38.74 D11.A 29.5,42.83 v27.95,41.28 | v62.33,50.89 D15.A 61.5,48.26 61.5,46.21 D5.C | v69.86,61.28 70.81,62.23 72.62,62.23 U1.5 | 56.83,37.14 D13.C 54.97,38.42 53.99,38.42 53.67,38.74 v47,38.74 | v23.19,42.55 23.19,46.67 D7.A 22.55,47.92 22.24,48.23 22.24,51.28 v22.43,51.47 | v24.46,57.15 24.34,57.04 D3.A | v48.27,57.15 v58.43,57.15
PWM1  (via drill 0.3)
  Top 0.178: v15.16,41.41 v12.25,44.82 | v41.92,55.88 45.73,59.69 v67.32,59.69 | v12.25,52.53 10.81,53.98 10.81,57.15 v12.08,58.42 | v13.98,58.42 15.25,57.15 v18.43,57.15 | v41.83,44.9 v41.83,41.5 | v40.65,40.33 20.65,40.33 v20.33,40.64 | v42.56,49.53 42.56,50.8 v41.29,52.07
  Bottom 0.178: v15.16,41.41 D14.C 19.56,41.41 v20.33,40.64 | v12.25,44.82 D6.C v12.25,52.53 | D8.A 37.18,54.05 D4.A 37.23,56.59 38.11,57.47 v38.11,60.01 | D8.A v41.92,55.88 | U1.6 73.99,62.14 73.99,60.33 73.35,59.69 v67.32,59.69 67.32,45.72 66.13,44.54 D16.A 64.76,40.38 D10.C | D2.C 18.95,55.45 | 19.06,55.05 D2.C | v12.08,58.42 v13.98,58.42 | v18.43,57.15 18.74,56.84 18.74,55.37 D2.C | v41.83,44.9 41.27,45.41 D12.A 39.91,46.88 v42.56,49.53 | v41.83,41.5 v40.65,40.33 | D8.A 39.16,52.07 v41.29,52.07
SENSE  (via drill 0.3)
  Top 0.178: v48.27,36.83 v48.27,54.61 | v57.16,55.88 58.43,54.61 58.43,53.34 62.24,49.53 72.4,49.53 v75.26,52.39
  Bottom 0.178: U1.2 | R17.2 60.64,27 57.16,30.48 52.08,30.48 48.27,34.29 v48.27,36.83 | v48.27,54.61 49.54,55.88 v57.16,55.88 | v75.26,52.39 75.26,55.41 U1.2 | R18.2 78.12,64.58 78.12,60.96 75.24,58.09 U1.2
VCC
  Bottom 0.178: JP3.1 68.41,80.38 Q1.1
VCC1
  pour Bottom: 0.01,0 91.36,0 91.36,104.22 50.81,104.14 50.81,87 36.84,87 36.84,104.22 0.01,104.22
(copper drawn outside any net)
  shapes: Top area x927

### Text on the board
tPlace: CUT OUT
bPlace: DC 503 | Up to the minute details / at http://503.party | cordially invites / you to put your / bird on our / little schindig | Artwork by / @remeranAuthor | Warthog9 put / a bird on it | Made In / PDX